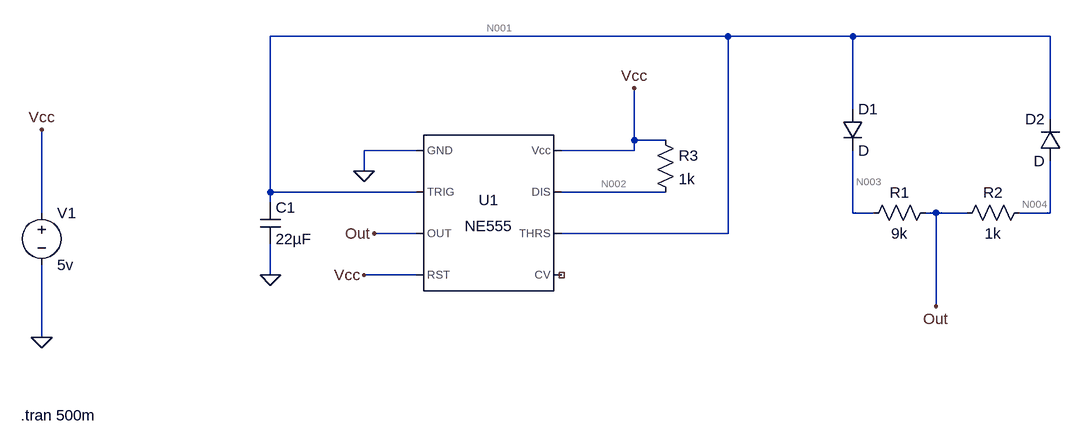
[diagram p0: schematic Draft1.asc]
Draft1.asc, the LTspice schematic file:
Version 4
SHEET 1 1140 680
WIRE 592 -64 -112 -64
WIRE 784 -64 592 -64
WIRE 1088 -64 784 -64
WIRE 784 48 784 -64
WIRE 1088 64 1088 -64
WIRE 448 96 448 16
WIRE 496 96 448 96
WIRE 112 112 32 112
WIRE 448 112 448 96
WIRE 448 112 336 112
WIRE 32 144 32 112
WIRE -112 176 -112 -64
WIRE 112 176 -112 176
WIRE 496 176 336 176
WIRE -112 192 -112 176
WIRE -464 208 -464 80
WIRE 784 208 784 112
WIRE 816 208 784 208
WIRE 912 208 896 208
WIRE 960 208 912 208
WIRE 1088 208 1088 128
WIRE 1088 208 1040 208
WIRE 112 240 48 240
WIRE 592 240 592 -64
WIRE 592 240 336 240
WIRE -112 304 -112 256
WIRE 112 304 32 304
WIRE 912 352 912 208
WIRE -464 400 -464 288
FLAG -464 400 0
FLAG -464 80 Vcc
FLAG 32 304 Vcc
FLAG 448 16 Vcc
FLAG -112 304 0
FLAG 48 240 Out
FLAG 912 352 Out
FLAG 32 144 0
SYMBOL Misc\\NE555 224 208 R0
SYMATTR InstName U1
SYMBOL voltage -464 192 R0
WINDOW 123 0 0 Left 0
WINDOW 39 0 0 Left 0
SYMATTR InstName V1
SYMATTR Value 5v
SYMBOL cap -128 192 R0
SYMATTR InstName C1
SYMATTR Value 22µF
SYMBOL diode 768 48 R0
SYMATTR InstName D1
SYMBOL diode 1104 128 R180
WINDOW 0 24 64 Left 2
WINDOW 3 24 0 Left 2
SYMATTR InstName D2
SYMBOL res 912 192 R90
WINDOW 0 0 56 VBottom 2
WINDOW 3 32 56 VTop 2
SYMATTR InstName R1
SYMATTR Value 9k
SYMBOL res 1056 192 R90
WINDOW 0 0 56 VBottom 2
WINDOW 3 32 56 VTop 2
SYMATTR InstName R2
SYMATTR Value 1k
SYMBOL res 480 80 R0
SYMATTR InstName R3
SYMATTR Value 1k
TEXT -496 520 Left 2 !.tran 500m

The netlist it stands for:
* Draft1.asc
XU1 0 N001 Out Vcc NC_01 N001 N002 Vcc NE555  ; pins GND TRIG OUT RST CV THRS DIS Vcc
V1 Vcc 0 5v
C1 N001 0 22µF
D1 N001 N003 D
D2 N004 N001 D
R1 Out N003 9k
R2 N004 Out 1k
R3 Vcc N002 1k
.model D D
.lib standard.dio
.tran 500m
.lib NE555.sub
.backanno
.end

* Results of the author's LTspice run, read from the files saved beside the schematic
* Operating Point, zero values left out:
*   V(n001) = 4.645 V
*   V(vcc) = 5 V
*   V(n002) = 5 V
*   V(out) = 5 V
*   V(n003) = 5 V
*   V(n004) = 5 V
*   I(D2) = 9.299 nA
*   I(R3) = 6.672 nA
*   I(R2) = -9.289 nA
*   I(V1) = -1.611 mA
*   Ix(u1:1) = -1.611 mA
*   Ix(u1:2) = 4.645 nA
*   Ix(u1:3) = -9.289 nA
*   Ix(u1:4) = 22.67 µA
*   Ix(u1:6) = 4.645 nA
*   Ix(u1:7) = 6.672 nA
*   Ix(u1:8) = 1.588 mA
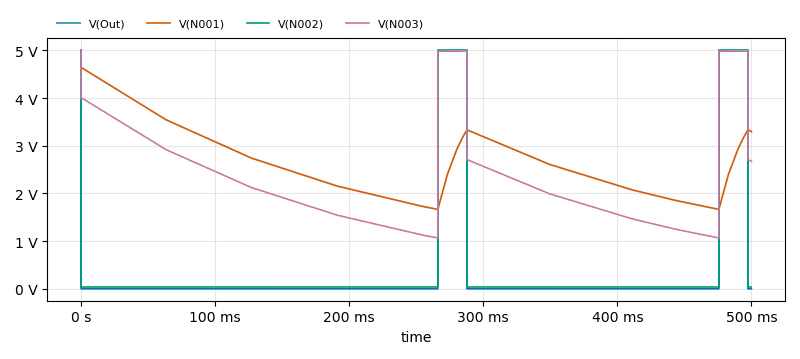
[diagram p1: Transient Analysis of Draft1.asc, plotted from the saved traces]
* Transient Analysis, 1 run:
*   V(Out): min 740 µV, max 5 V, average 434.9 mV, rms 1.471 V, last 1.812 mV
*   V(N001): min 1.666 V, max 4.645 V, average 2.659 V, rms 2.773 V, last 3.299 V
*   V(N002): min 29.82 mV, max 5 V, average 461.7 mV, rms 1.474 V, last 29.82 mV
*   V(N003): min 1.066 V, max 5 V, average 2.303 V, rms 2.564 V, last 2.675 V